# EAGLE design basis108_xt_keyboard (EAGLE 6.5.0)
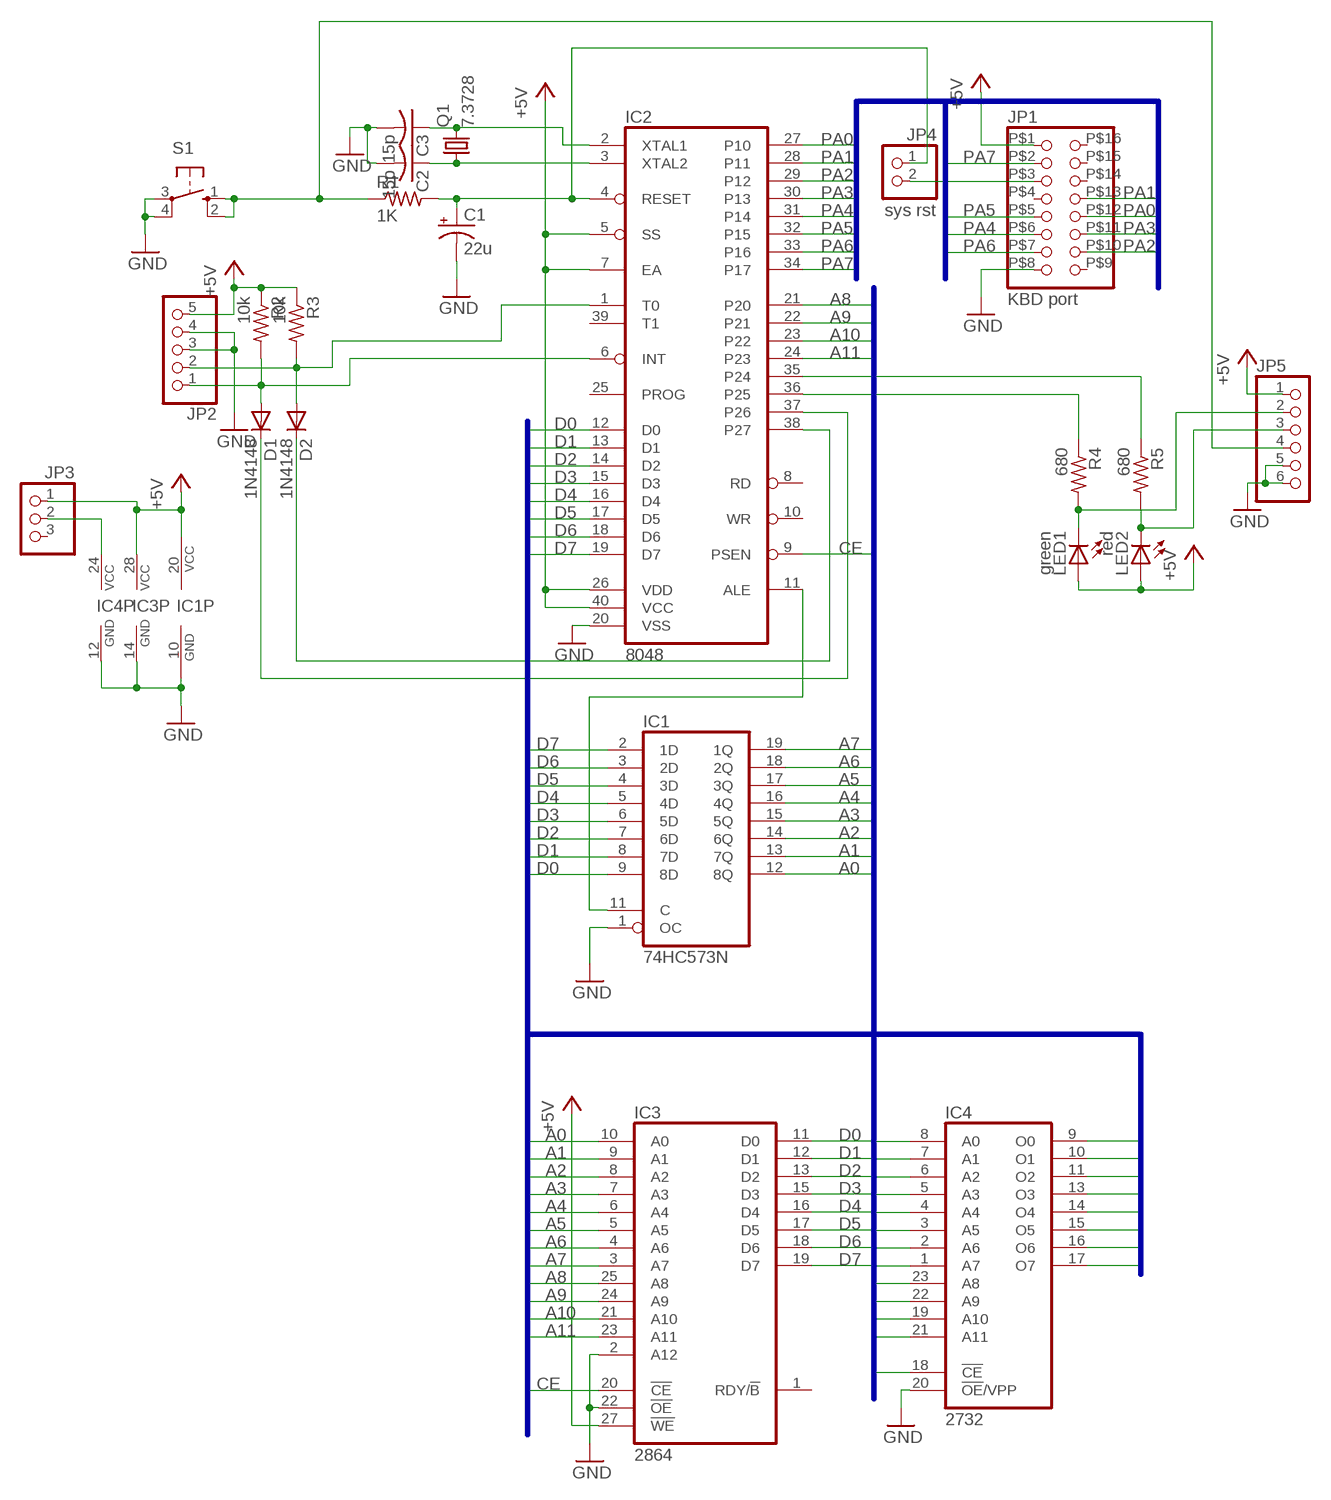
[diagram p0: schematic, sheet 1]

## Parts
C1  22u  CPOL-USE2.5-6  [E2,5-6]
C2  15p  C-US025-040X050  [C025-040X050]
C3  15p  C-US025-040X050  [C025-040X050]
D1  1N4148  1N4148DO35-7  [DO35-7]
D2  1N4148  1N4148DO35-7  [DO35-7]
IC1  74HC573N  [DIL20]
IC2  8048  [DIL40]
IC3  2864  [DIL28]
IC4  2732  [DIL24]
JP1  KBD port  PINHD-2X8  [2X8DIL]
JP2  PINHD-1X5  [1X05]
JP3  PINHD-1X3  [1X03]
JP4  sys rst  PINHD-1X2  [1X02]
JP5  PINHD-1X6  [1X06]
LED1  green  LED3MM  [LED3MM]
LED2  red  LED3MM  [LED3MM]
Q1  7.3728  CRYSTALHC49U-H  [HC49U-H]
R1  1K  R-US_0204/7  [0204/7]
R2  10k  R-US_0204/7  [0204/7]
R3  10k  R-US_0204/7  [0204/7]
R4  680  R-US_0204/7  [0204/7]
R5  680  R-US_0204/7  [0204/7]
S1  10-XX  [B3F-10XX]

## Nets
+5V: IC1.20(VCC) IC2.5(SS) IC2.7(EA) IC2.26(VDD) IC2.40(VCC) IC3.27(!WE) IC3.28(VCC) JP1.P$1 JP2.5 JP3.1 JP5.1 LED1.A LED2.A R2.1 R3.1
A0: IC1.12(8Q) IC3.10(A0) IC4.8(A0)
A1: IC1.13(7Q) IC3.9(A1) IC4.7(A1)
A2: IC1.14(6Q) IC3.8(A2) IC4.6(A2)
A3: IC1.15(5Q) IC3.7(A3) IC4.5(A3)
A4: IC1.16(4Q) IC3.6(A4) IC4.4(A4)
A5: IC1.17(3Q) IC3.5(A5) IC4.3(A5)
A6: IC1.18(2Q) IC3.4(A6) IC4.2(A6)
A7: IC1.19(1Q) IC3.3(A7) IC4.1(A7)
A8: IC2.21(P20) IC3.25(A8) IC4.23(A8)
A9: IC2.22(P21) IC3.24(A9) IC4.22(A9)
A10: IC2.23(P22) IC3.21(A10) IC4.19(A10)
A11: IC2.24(P23) IC3.23(A11) IC4.21(A11)
ALE: IC1.11(C) IC2.11(ALE)
CE: IC2.9(PSEN) IC3.20(!CE) IC4.18(!CE)
D0: IC1.9(8D) IC2.12(D0) IC3.11(D0) IC4.9(O0)
D1: IC1.8(7D) IC2.13(D1) IC3.12(D1) IC4.10(O1)
D2: IC1.7(6D) IC2.14(D2) IC3.13(D2) IC4.11(O2)
D3: IC1.6(5D) IC2.15(D3) IC3.15(D3) IC4.13(O3)
D4: IC1.5(4D) IC2.16(D4) IC3.16(D4) IC4.14(O4)
D5: IC1.4(3D) IC2.17(D5) IC3.17(D5) IC4.15(O5)
D6: IC1.3(2D) IC2.18(D6) IC3.18(D6) IC4.16(O6)
D7: IC1.2(1D) IC2.19(D7) IC3.19(D7) IC4.17(O7)
GND: C1.- C2.2 C3.2 IC1.1(OC) IC1.10(GND) IC2.20(VSS) IC3.2(A12) IC3.14(GND) IC3.22(!OE) IC4.12(GND) IC4.20(!OE!/VPP) JP1.P$8 JP2.3 JP2.4 JP5.5 JP5.6 S1.3(P) S1.4(P1)
N$1: C2.1 IC2.3(XTAL2) Q1.1
N$2: C3.1 IC2.2(XTAL1) Q1.2
N$3: C1.+ IC2.4(RESET) JP4.1 R1.2
N$4: IC4.24(VCC) JP3.2
N$5: JP5.4 R1.1 S1.1(S) S1.2(S1)
N$6: D1.A IC2.6(INT) JP2.1 R2.2
N$7: D2.A IC2.1(T0) JP2.2 R3.2
N$8: D2.C IC2.38(P27)
N$9: D1.C IC2.37(P26)
N$10: IC2.36(P25) R4.1
N$11: IC2.35(P24) R5.1
N$12: JP5.3 LED2.K(C) R5.2
N$13: JP5.2 LED1.K(C) R4.2
N$14: JP1.P$3 JP4.2
PA0: IC2.27(P10) JP1.P$12
PA1: IC2.28(P11) JP1.P$13
PA2: IC2.29(P12) JP1.P$10
PA3: IC2.30(P13) JP1.P$11
PA4: IC2.31(P14) JP1.P$6
PA5: IC2.32(P15) JP1.P$5
PA6: IC2.33(P16) JP1.P$7
PA7: IC2.34(P17) JP1.P$2
Unconnected: IC2.8(RD) IC2.10(WR) IC2.25(PROG) IC2.39(T1) IC3.1(RDY/!B) JP1.P$4 JP1.P$9 JP1.P$14 JP1.P$15 JP1.P$16 JP3.3

## Buses
D[0..7],A[0..15],RD,WR,CE
PA[0..7]

## Library data of the parts
C1 = resistor:CPOL-US: POLARIZED CAPACITOR, American symbol
C2 C3 = resistor:C-US: CAPACITOR, American symbol
D1 D2 = diode:1N4148: DIODE high speed (Philips)
IC1 = 74xx-us:74*573: 8-bit D latch BUS DRIVER
IC2 = micro-intel:8048: MICROCOMPUTER/PERIPHERAL DEVICE; OC_FARNELL: unknown; OC_NEWARK: unknown
IC3 = memory:2864: MEMORY
IC4 = memory:2732: MEMORY
JP1 = pinhead:PINHD-2X8: PIN HEADER
JP2 = pinhead:PINHD-1X5: PIN HEADER
JP3 = pinhead:PINHD-1X3: PIN HEADER
JP4 = pinhead:PINHD-1X2: PIN HEADER
JP5 = pinhead:PINHD-1X6: PIN HEADER
LED1 LED2 = led:LED: LED OSRAM: - CHIPLED LG R971, LG N971, LY N971, LG Q971, LY Q971, LO R971, LY R971 LH N974, LH R974 LS Q976, LO Q976, LY Q976 LO Q996 - Hyper CHIPLED LW Q18S LB Q993, LB Q99A, LB R99A - SideLED LS A670, LO A670, LY A670, LG A670, LP A670 LB A673, LV A673, LT A673, LW A673 LH A674 LY A675 LS A676, LA A676, LO A676, LY A676, LW A676 LS A679, LY A679, LG A679 - Hyper Micro SIDELED® LS Y876, LA Y876, LO Y876, LY Y876 LT Y87S - SmartLED LW L88C, LW L88S LB L89C, LB L89S, LG L890 LS L89K, LO L89K, LY L89K LS L896, LA L896, LO L896, LY L896 - TOPLED LS T670, LO T670, LY T670, LG T670, LP T670 LSG T670, LSP T670, LSY T670, LOP T670, LYG T670 LG T671, LOG T671, LSG T671 LB T673, LV T673, LT T673, LW T673 LH T674 LS T676, LA T676, LO T676, LY T676, LB T676, LH T676, LSB T676, LW T676 LB T67C, LV T67C, LT T67C, LS T67K, LO T67K, LY T67K, LW E67C LS E67B, LA E67B, LO E67B, LY E67B, LB E67C, LV E67C, LT E67C LW T67C LS T679, LY T679, LG T679 LS T770, LO T770, LY T770, LG T770, LP T770 LB T773, LV T773, LT T773, LW T773 LH T774 LS E675, LA E675, LY E675, LS T675 LS T776, LA T776, LO T776, LY T776, LB T776 LHGB T686 LT T68C, LB T68C - Hyper Mini TOPLED® LB M676 - Mini TOPLED Santana® LG M470 LS M47K, LO M47K, LY M47K Source: http://www.osram.convergy.de LUXEON: - LUMILED® LXK2-PW12-R00, LXK2-PW12-S00, LXK2-PW14-U00, LXK2-PW14-V00 LXK2-PM12-R00, LXK2-PM12-S00, LXK2-PM14-U00 LXK2-PE12-Q00, LXK2-PE12-R00, LXK2-PE12-S00, LXK2-PE14-T00, LXK2-PE14-U00 LXK2-PB12-K00, LXK2-PB12-L00, LXK2-PB12-M00, LXK2-PB14-N00, LXK2-PB14-P00, LXK2-PB14-Q00 LXK2-PR12-L00, LXK2-PR12-M00, LXK2-PR14-Q00, LXK2-PR14-R00 LXK2-PD12-Q00, LXK2-PD12-R00, LXK2-PD12-S00 LXK2-PH12-R00, LXK2-PH12-S00 LXK2-PL12-P00, LXK2-PL12-Q00, LXK2-PL12-R00 Source: www.luxeon.com KINGBRIGHT: KA-3528ASYC Source: www.kingbright.com
Q1 = crystal:CRYSTAL: CRYSTAL; OC_FARNELL: 1666973; OC_NEWARK: unknown
R1-R5 = resistor:R-US_: RESISTOR, American symbol
S1 = switch-omron:10-XX: OMRON SWITCH; MPN: B3F-1000; OC_FARNELL: 176432; OC_NEWARK: 36M3542

## Board
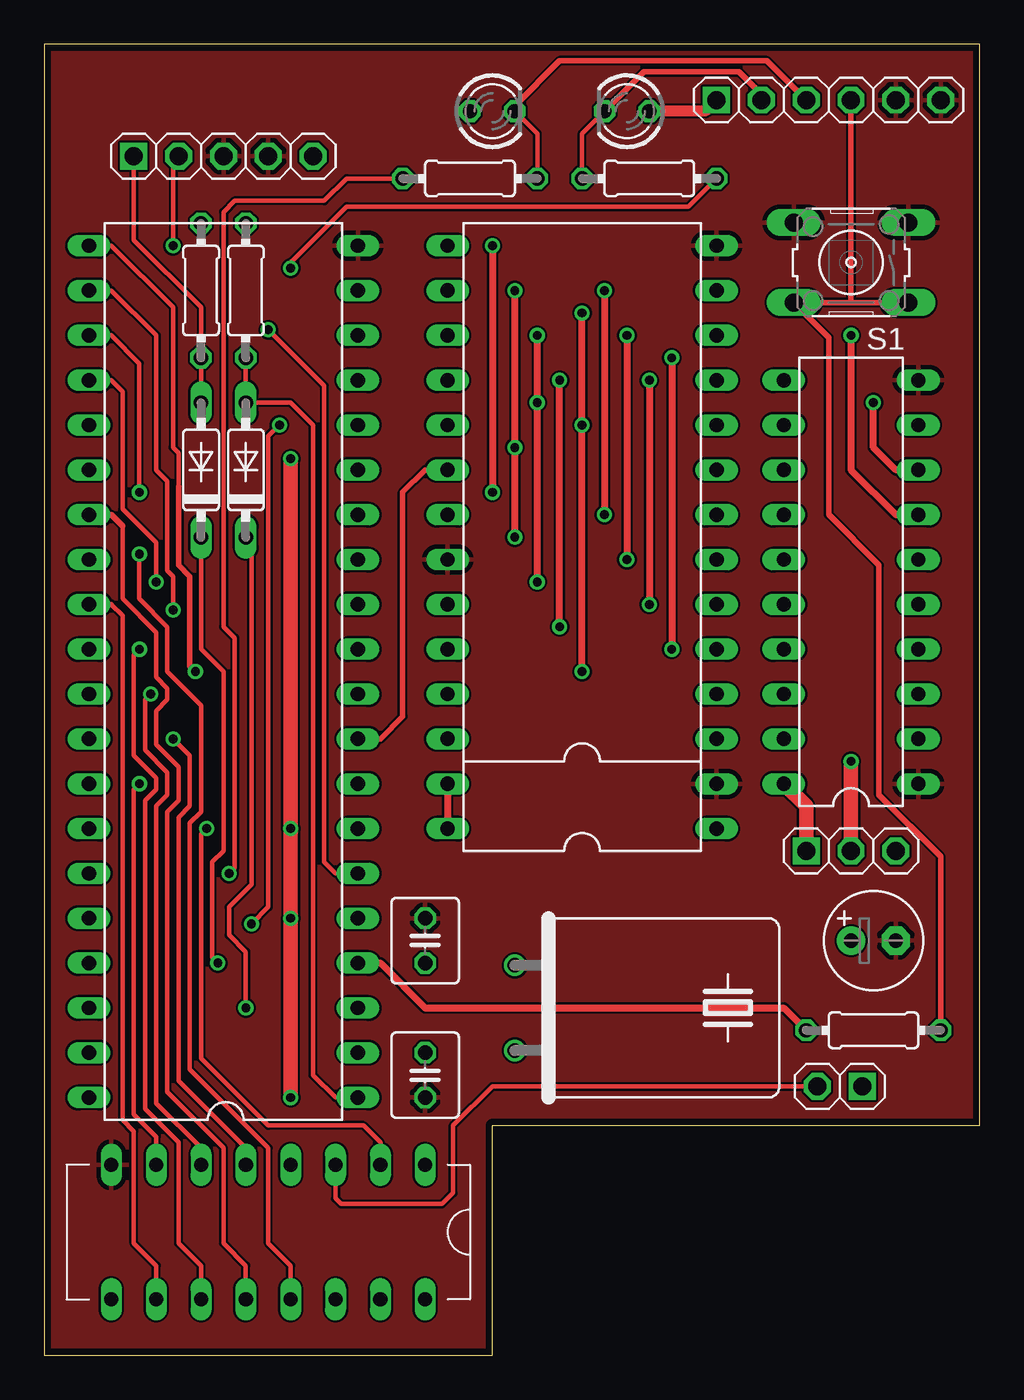
[diagram p1: board, top side]
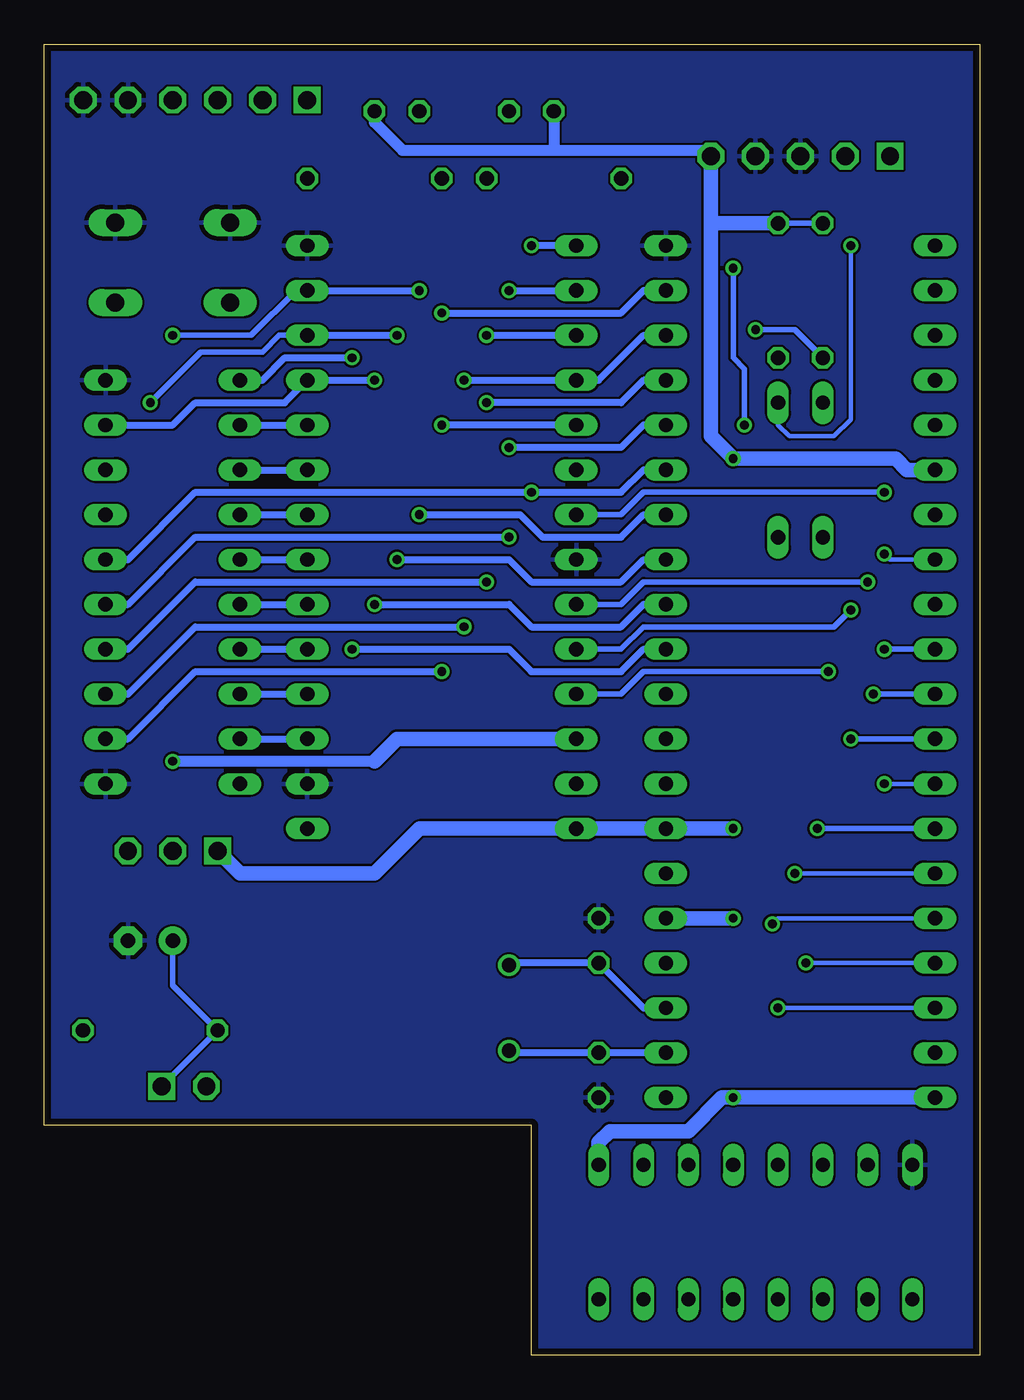
[diagram p2: board, bottom side, seen from below]

Size 53.01 x 74.28 mm. Coordinates in mm from the lower left corner, seen from the top.
Outline: 0,0 25.4,0 25.4,13.02 53.01,13.02 53.01,74.28 0,74.28 0,0
Copper layers (1*16): Top 0.0356mm / dielectric 1.5011mm / Bottom 0.0356mm
Design rules "JLCPCB": minimum track width 5mil, minimum drill 0.2mm, track to track 5mil, track to pad 0.33mm, pad to pad 5mil, via to via 10mil, smd to smd 5mil, copper to edge 15mil, drill to drill 0.5mm, minimum pad ring 7mil, minimum via ring 7mil, stop-mask expansion 4mil, vias tented up to drill 20mil, thermal gap 10mil

### Footprints (pad centres in the part's own frame; a part is rotated, then mirrored left to right if it is on the bottom)
E2,5-6 = drill 0.813 pad 1.6: + -1.27,0 | drill 0.813 pad 1.6 octagon: - 1.27,0
C025-040X050 = drill 0.813 octagon: 1 -1.27,0; 2 1.27,0
DO35-7 = drill 0.813 long: A 3.81,0; C -3.81,0
DIL20 = drill 0.813 long: 1 -11.43,-3.81; 2 -8.89,-3.81; 3 -6.35,-3.81; 4 -3.81,-3.81; 5 -1.27,-3.81; 6 1.27,-3.81; 7 3.81,-3.81; 8 6.35,-3.81; 9 8.89,-3.81; 10 11.43,-3.81; 11 11.43,3.81; 12 8.89,3.81; 13 6.35,3.81; 14 3.81,3.81; 15 1.27,3.81; 16 -1.27,3.81; 17 -3.81,3.81; 18 -6.35,3.81; 19 -8.89,3.81; 20 -11.43,3.81
DIL40 = drill 0.813 long: 1 -24.13,-7.62; 2 -21.59,-7.62; 3 -19.05,-7.62; 4 -16.51,-7.62; 5 -13.97,-7.62; 6 -11.43,-7.62; 7 -8.89,-7.62; 8 -6.35,-7.62; 9 -3.81,-7.62; 10 -1.27,-7.62; 11 1.27,-7.62; 12 3.81,-7.62; 13 6.35,-7.62; 14 8.89,-7.62; 15 11.43,-7.62; 16 13.97,-7.62; 17 16.51,-7.62; 18 19.05,-7.62; 19 21.59,-7.62; 20 24.13,-7.62; 21 24.13,7.62; 22 21.59,7.62; 23 19.05,7.62; 24 16.51,7.62; 25 13.97,7.62; 26 11.43,7.62; 27 8.89,7.62; 28 6.35,7.62; 29 3.81,7.62; 30 1.27,7.62; 31 -1.27,7.62; 32 -3.81,7.62; 33 -6.35,7.62; 34 -8.89,7.62; 35 -11.43,7.62; 36 -13.97,7.62; 37 -16.51,7.62; 38 -19.05,7.62; 39 -21.59,7.62; 40 -24.13,7.62
DIL28 = drill 0.813 long: 1 -16.51,-7.62; 2 -13.97,-7.62; 3 -11.43,-7.62; 4 -8.89,-7.62; 5 -6.35,-7.62; 6 -3.81,-7.62; 7 -1.27,-7.62; 8 1.27,-7.62; 9 3.81,-7.62; 10 6.35,-7.62; 11 8.89,-7.62; 12 11.43,-7.62; 13 13.97,-7.62; 14 16.51,-7.62; 15 16.51,7.62; 16 13.97,7.62; 17 11.43,7.62; 18 8.89,7.62; 19 6.35,7.62; 20 3.81,7.62; 21 1.27,7.62; 22 -1.27,7.62; 23 -3.81,7.62; 24 -6.35,7.62; 25 -8.89,7.62; 26 -11.43,7.62; 27 -13.97,7.62; 28 -16.51,7.62
DIL24 = drill 0.813 long: 1 -13.97,-7.62; 2 -11.43,-7.62; 3 -8.89,-7.62; 4 -6.35,-7.62; 5 -3.81,-7.62; 6 -1.27,-7.62; 7 1.27,-7.62; 8 3.81,-7.62; 9 6.35,-7.62; 10 8.89,-7.62; 11 11.43,-7.62; 12 13.97,-7.62; 13 13.97,7.62; 14 11.43,7.62; 15 8.89,7.62; 16 6.35,7.62; 17 3.81,7.62; 18 1.27,7.62; 19 -1.27,7.62; 20 -3.81,7.62; 21 -6.35,7.62; 22 -8.89,7.62; 23 -11.43,7.62; 24 -13.97,7.62
2X8DIL = drill 0.8 long: P$1 -3.81,8.89; P$2 -3.81,6.35; P$3 -3.81,3.81; P$4 -3.81,1.27; P$5 -3.81,-1.27; P$6 -3.81,-3.81; P$7 -3.81,-6.35; P$8 -3.81,-8.89; P$9 3.81,-8.89; P$10 3.81,-6.35; P$11 3.81,-3.81; P$12 3.81,-1.27; P$13 3.81,1.27; P$14 3.81,3.81; P$15 3.81,6.35; P$16 3.81,8.89
1X05 = drill 1.016 square: 1 -5.08,0 | drill 1.016 octagon: 2 -2.54,0; 3 0,0; 4 2.54,0; 5 5.08,0
1X03 = drill 1.016 square: 1 -2.54,0 | drill 1.016 octagon: 2 0,0; 3 2.54,0
1X02 = drill 1.016 square: 1 -1.27,0 | drill 1.016 octagon: 2 1.27,0
1X06 = drill 1.016 square: 1 -6.35,0 | drill 1.016 octagon: 2 -3.81,0; 3 -1.27,0; 4 1.27,0; 5 3.81,0; 6 6.35,0
LED3MM = drill 0.813 octagon: A -1.27,0; K 1.27,0
HC49U-H = drill 0.813: 1 -2.413,-5.08; 2 2.413,-5.08
0204/7 = drill 0.813 octagon: 1 -3.81,0; 2 3.81,0
B3F-10XX = drill 1.016 long: 1 -3.251,2.261; 2 3.251,2.261; 3 -3.251,-2.261; 4 3.251,-2.261

### Placement (x,y rotation side)
C1  46.99,23.5 0 top
C2  21.59,23.5 90 top
C3  21.59,15.88 270 top
D1  8.89,50.16 90 top
D2  11.43,50.16 90 top
IC1  45.72,43.81 90 top
IC2  10.16,38.73 90 top
IC3  30.48,46.35 90 top
IC4  30.48,48.9 90 top
JP1  12.7,6.99 270 top
JP2  10.16,67.94 0 top
JP3  45.72,28.57 0 top
JP4  45.09,15.24 180 top
JP5  44.45,71.12 0 top
LED1  33.02,70.48 180 top
LED2  25.4,70.48 0 top
Q1  31.75,19.68 270 top
R1  46.99,18.41 180 top
R2  8.89,60.33 270 top
R3  11.43,60.33 270 top
R4  34.29,66.67 180 top
R5  24.13,66.67 0 top
S1  45.72,61.91 180 top

### Tracks (layer width: path | path; a pad name or v marks a point on that pad's centre or on a via)
+5V  (via drill 0.5)
  Top 0.406: IC3.27 IC3.28
  Top 0.61: JP5.1 37.47,70.48 LED1.A
  Top 0.813: v13.97,14.61 v13.97,24.77 v13.97,29.84 v13.97,50.8 | JP3.1 43.18,31.11 IC1.20
  Bottom 0.305: R2.1 R3.1
  Bottom 0.61: 24.13,68.26 32.7,68.26 34.29,69.85 LED1.A | 24.13,68.26 15.56,68.26 JP2.5 | LED2.A 24.13,68.26
  Bottom 0.813: v13.97,24.77 IC2.5 | v13.97,29.84 IC2.7 IC3.28 31.75,29.84 34.29,27.3 41.91,27.3 JP3.1 | 15.24,64.14 R3.1 | IC2.26 4.13,50.16 4.76,50.8 v13.97,50.8 15.24,52.07 15.24,64.14 | 15.24,64.14 JP2.5 | JP1.P$1 21.59,12.06 20.95,12.7 16.51,12.7 14.61,14.61 v13.97,14.61 IC2.40
A0
  Bottom 0.406: IC1.12 IC3.10
A1
  Bottom 0.406: IC1.13 IC3.9
A2
  Bottom 0.406: IC1.14 IC4.6
A3
  Bottom 0.406: IC1.15 IC4.5
A4
  Bottom 0.406: IC1.16 IC4.4
A5
  Bottom 0.406: IC1.17 IC4.3
A6
  Bottom 0.406: IC1.18 IC4.2
A7
  Bottom 0.406: IC1.19 IC3.3
A8  (via drill 0.5)
  Top 0.254: 7.62,49.21 7.62,51.12 7.3,51.44 7.3,59.37 3.81,62.87 IC2.21
  Top 0.305: v8.57,38.73 8.26,39.05 8.26,44.13 7.62,44.77 7.62,49.21
  Bottom 0.305: IC4.23 20.32,37.47 19.05,38.73 v8.57,38.73
A9  (via drill 0.5)
  Top 0.254: IC2.22 3.81,60.33 6.35,57.78 6.35,50.16 6.99,49.53 6.99,44.45 7.3,44.13 v7.3,42.23
  Bottom 0.305: IC4.22 20.32,40.01 19.05,41.27 8.26,41.27 v7.3,42.23
A10  (via drill 0.5)
  Top 0.254: v5.4,48.9 5.4,56.2 3.81,57.78 IC2.23
  Bottom 0.305: v5.4,48.9 19.05,48.9 20.32,47.62 IC4.19
A11  (via drill 0.5)
  Top 0.254: IC2.24 3.81,55.24 4.45,54.61 4.45,47.94 6.35,46.04 v6.35,43.81
  Bottom 0.305: IC4.21 20.32,42.55 19.05,43.81 v6.35,43.81
ALE  (via drill 0.5)
  Top 0.406: v35.56,56.52 v35.56,40.01
  Bottom 0.406: IC1.11 40.64,55.24 39.37,56.52 v35.56,56.52 | v35.56,40.01 26.67,40.01 25.4,38.73 20.32,38.73 19.05,40.01 IC2.11
CE
  Top 0.305: IC2.9 19.05,34.92 20.32,36.2 20.32,48.9 21.59,50.16 IC3.20
D0  (via drill 0.5)
  Top 0.406: v34.29,55.24 v34.29,42.55
  Bottom 0.406: IC1.9 45.72,52.7 44.45,53.98 39.37,53.98 IC3.11 v34.29,55.24 | v34.29,42.55 26.67,42.55 25.4,41.27 20.32,41.27 19.05,42.55 IC2.12
D1  (via drill 0.5)
  Top 0.406: IC1.8 48.26,50.16 46.99,51.44 v46.99,53.98 | v33.02,57.78 v33.02,45.09
  Bottom 0.305: IC3.12 39.69,57.78 40.64,56.83 44.13,56.83 v46.99,53.98
  Bottom 0.406: IC3.12 v33.02,57.78 | v33.02,45.09 26.67,45.09 25.4,43.81 20.32,43.81 19.05,45.09 IC2.13
D2  (via drill 0.5)
  Top 0.406: v45.72,57.78 45.72,50.16 48.26,47.62 IC1.7 | v31.75,60.33 v31.75,47.62
  Bottom 0.305: IC4.11 38.73,60.33 41.27,57.78 v45.72,57.78
  Bottom 0.406: IC4.11 v31.75,60.33 | v31.75,47.62 26.04,47.62 24.77,46.35 20.32,46.35 19.05,47.62 IC2.14
D3  (via drill 0.5)
  Top 0.406: v25.4,62.87 v25.4,48.9
  Bottom 0.406: IC1.6 48.26,45.09 44.45,48.9 v25.4,48.9 20.32,48.9 19.05,50.16 IC2.15 | IC4.13 v25.4,62.87
D4  (via drill 0.5)
  Top 0.406: v26.67,46.35 v26.67,51.44 v26.67,60.33
  Bottom 0.406: IC1.5 48.26,42.55 44.45,46.35 v26.67,46.35 | v26.67,60.33 IC4.14 | IC2.16 19.05,52.7 20.32,51.44 v26.67,51.44
D5  (via drill 0.5)
  Top 0.406: v27.94,43.81 v27.94,53.98 v27.94,57.78
  Bottom 0.406: IC1.4 48.26,40.01 44.45,43.81 v27.94,43.81 | v27.94,57.78 IC3.17 | IC2.17 19.05,55.24 20.32,53.98 v27.94,53.98
D6  (via drill 0.5)
  Top 0.406: v29.21,41.27 v29.21,55.24
  Bottom 0.406: IC1.3 48.26,37.47 44.45,41.27 v29.21,41.27 | v29.21,55.24 IC3.18 21.59,55.24 19.05,57.78 IC2.18
D7  (via drill 0.5)
  Top 0.406: v30.48,38.73 v30.48,52.7 v30.48,59.05
  Bottom 0.406: IC1.2 48.26,34.92 44.45,38.73 v30.48,38.73 | v30.48,59.05 20.32,59.05 19.05,60.33 IC2.19 | IC3.19 v30.48,52.7
GND
  pour Bottom: -1.27,-1.91 54.61,-1.91 54.61,75.56 -1.27,75.56
  pour Top: -2.54,-3.17 55.88,-3.17 55.88,76.83 -2.54,76.83
N$1
  Bottom 0.406: IC2.3 19.05,19.68 C2.1 26.54,22.23 Q1.1
N$2
  Bottom 0.406: IC2.2 C3.1 26.54,17.14 Q1.2
N$3
  Top 0.406: IC2.4 19.05,22.23 21.59,19.68 41.91,19.68 R1.2
  Bottom 0.305: C1.+ 45.72,20.95 R1.2 JP4.1
N$4  (via drill 0.5)
  Top 0.813: v45.72,33.66 JP3.2
  Bottom 0.61: 34.29,33.66 v45.72,33.66
  Bottom 0.813: IC4.24 33.02,34.92 34.29,33.66
N$5
  Top 0.305: R1.1 50.8,28.26 47.31,31.75 47.31,44.77 44.45,47.62 44.45,57.67 S1.2 45.72,59.65 | S1.1 45.72,59.65 | JP5.4 45.72,59.65
N$6  (via drill 0.5)
  Top 0.254: JP2.1 5.08,63.18 8.89,59.37 R2.2 D1.A | v12.7,58.1 15.88,54.93 15.88,27.94 16.51,27.3 IC2.6
  Bottom 0.305: v12.7,58.1 10.48,58.1 R2.2
N$7  (via drill 0.5)
  Top 0.254: R3.2 D2.A 13.97,53.98 15.24,52.7 15.24,15.88 16.51,14.61 IC2.1 | JP2.2 7.3,67.63 v7.3,62.87
  Bottom 0.254: v7.3,62.87 7.3,53.02 8.26,52.07 10.79,52.07 11.43,52.7 D2.A
N$8  (via drill 0.5)
  Top 0.254: v11.43,19.68 11.43,22.86 10.48,23.81 10.48,25.4 11.75,26.67 11.75,46.04 D2.C
  Bottom 0.254: IC2.38 v11.43,19.68
N$9  (via drill 0.5)
  Top 0.254: v9.84,22.23 9.53,22.54 9.53,27.94 10.16,28.57 10.16,38.73 8.89,40.01 D1.C
  Bottom 0.254: IC2.37 v9.84,22.23
N$10  (via drill 0.5)
  Top 0.254: v13.34,52.7 12.7,52.07 12.7,25.4 v11.75,24.45 | 13.97,61.91 17.14,65.09 36.51,65.09 R4.1
  Top 0.305: v13.97,61.59 13.97,61.91
  Bottom 0.254: IC2.36 11.43,24.77 v11.75,24.45
  Bottom 0.305: v13.34,52.7 13.34,55.88 13.97,56.52 v13.97,61.59
N$11  (via drill 0.5)
  Top 0.254: v10.48,27.3 10.79,27.62 10.79,40.64 10.16,41.27 10.16,64.77 10.79,65.41 15.88,65.41 17.14,66.67 R5.1
  Bottom 0.254: IC2.35 v10.48,27.3
N$12
  Top 0.254: R5.2 27.94,69.22 LED2.K
  Top 0.305: JP5.3 40.96,73.34 29.21,73.34 26.67,70.8 LED2.K
N$13
  Top 0.254: R4.2 30.48,69.22 LED1.K
  Top 0.305: LED1.K 33.97,72.71 39.37,72.71 40.64,71.44 JP5.2
N$14
  Top 0.254: JP1.P$3 16.51,8.89 16.83,8.57 22.54,8.57 23.18,9.21 23.18,13.02 25.4,15.24 JP4.2
PA0
  Top 0.254: JP1.P$12 11.43,5.08 10.16,6.35 10.16,11.75 6.99,14.92 6.99,30.8 7.62,31.43 7.62,33.34 6.35,34.61 6.35,36.51 6.99,37.15 6.99,37.78 6.35,38.42 6.35,40.96 4.45,42.86 4.45,46.99
  Top 0.305: 4.45,46.99 3.81,47.62 IC2.27
PA1  (via drill 0.5)
  Top 0.254: JP1.P$13 13.97,5.08 12.7,6.35 12.7,11.75 8.26,16.19 8.26,30.16 8.89,30.8 8.89,36.83 6.99,38.73 6.99,41.27 5.4,42.86 v5.4,45.4
  Bottom 0.254: IC2.28 5.08,45.09 v5.4,45.4
PA2
  Top 0.254: JP1.P$10 6.35,5.08 5.08,6.35 5.08,12.7 4.45,13.34 4.45,41.91 3.81,42.55
  Top 0.305: 3.81,42.55 IC2.29
PA3  (via drill 0.5)
  Top 0.254: JP1.P$11 8.89,5.08 7.62,6.35 7.62,12.06 5.71,13.97 5.71,31.43 6.35,32.07 6.35,32.7 5.08,33.97 5.08,39.69 v5.4,40.01
  Bottom 0.305: v5.4,40.01 IC2.30
PA4  (via drill 0.5)
  Top 0.254: JP1.P$6 8.89,11.75 6.35,14.29 6.35,31.11 6.99,31.75 6.99,33.02 5.71,34.29 5.71,37.15 v6.03,37.47
  Bottom 0.305: v6.03,37.47 IC2.31
PA5  (via drill 0.5)
  Top 0.254: JP1.P$5 11.43,11.75 7.62,15.56 7.62,30.48 8.26,31.11 8.26,33.97 v7.3,34.92
  Bottom 0.305: v7.3,34.92 IC2.32
PA6  (via drill 0.5)
  Top 0.254: JP1.P$7 6.35,12.38 5.08,13.65 5.08,32.07 v5.4,32.38
  Bottom 0.254: v5.4,32.38 IC2.33
PA7  (via drill 0.5)
  Top 0.254: JP1.P$2 19.05,12.06 18.1,13.02 12.7,13.02 8.89,16.83 8.89,29.53 v9.21,29.84
  Bottom 0.305: v9.21,29.84 IC2.34

### Text on the board
tValues: CLK | DATA | GND | 5V | +5 | SHIFT | CTRL | RST | GND | XT KBD | RESET | 2732 | 2864 | CPU / reset